# Altium schematic sheet HMC5883L.SchDoc: HMC5883L
size Letter
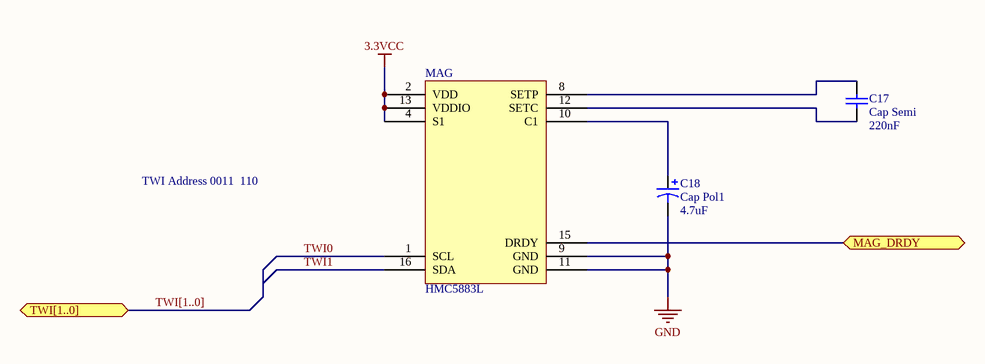
[diagram p0: HMC5883L.SchDoc]

## Parts
C17  Cap Semi  value 220nF  [CAPC2012N]
C18  Cap Pol1  value 4.7uF  [TC3528-1411]
MAG  HMC5883L  [HMC5883L - ECESHOP]

## Ports
MAG_DRDY, TWI[1..0] (bidir)

## Nets
3.3VCC: MAG.2(VDD) MAG.4(S1) MAG.13(VDDIO)
GND: C18.2 MAG.9(GND) MAG.11(GND)
MAG_DRDY: MAG.15(DRDY) ; port MAG_DRDY
TWI0: MAG.1(SCL)
TWI1: MAG.16(SDA)
NetC17_1: C17.1 MAG.8(SETP)
NetC17_2: C17.2 MAG.12(SETC)
NetC18_1: C18.1 MAG.10(C1)

Not connected (* = marked no-connect by the designer): MAG 3(NC) 5(NC) 6(NC) 7(NC) 14(NC)

## Buses and harness runs
bus TWI[1..0] = port TWI[1..0]

## Notes on the sheet
- TWI Address 0011  110
- Title
- Size:
- Date:
- Letter
- Number:
- Time:
- Revision:
- Sheet
- of
- File:

## Library data of the parts
C17 = Cap Semi: Capacitor (Semiconductor SIM Model); Published: 8-Jun-2000; LatestRevisionDate: 29-May-2009; LatestRevisionNote: IPC-7351 Footprint Added.; PackageReference: C1206; Publisher: Altium Limited; PackageDescription: Chip Capacitor
C18 = Cap Pol1: Polarized Capacitor (Radial); Published: 8-Jun-2000; LatestRevisionDate: 17-Jul-2002; LatestRevisionNote: Re-released for DXP Platform.; PackageReference: RB7.6-15; Publisher: Altium Limited; PackageDescription: Polarized Capacitor (Radial); 2 Leads